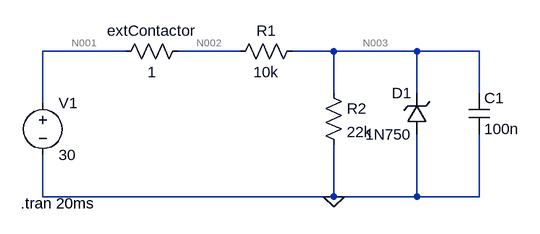
[diagram p0: schematic din.asc]
din.asc, the LTspice schematic file:
Version 4
SHEET 1 880 680
WIRE 112 96 -16 96
WIRE 288 96 192 96
WIRE 432 96 368 96
WIRE 560 96 432 96
WIRE 656 96 560 96
WIRE 432 160 432 96
WIRE 560 160 560 96
WIRE 656 160 656 96
WIRE -16 176 -16 96
WIRE -16 320 -16 256
WIRE 432 320 432 240
WIRE 432 320 -16 320
WIRE 560 320 560 224
WIRE 560 320 432 320
WIRE 656 320 656 224
WIRE 656 320 560 320
FLAG 432 320 0
SYMBOL voltage -16 160 R0
WINDOW 123 0 0 Left 2
WINDOW 39 0 0 Left 2
SYMATTR InstName V1
SYMATTR Value 30
SYMBOL res 208 80 R90
WINDOW 0 0 56 VBottom 2
WINDOW 3 32 56 VTop 2
SYMATTR InstName extContactor
SYMATTR Value 1
SYMBOL res 384 80 R90
WINDOW 0 0 56 VBottom 2
WINDOW 3 32 56 VTop 2
SYMATTR InstName R1
SYMATTR Value 10k
SYMBOL res 416 144 R0
SYMATTR InstName R2
SYMATTR Value 22k
SYMBOL zener 576 224 R180
WINDOW 0 24 64 Left 2
WINDOW 3 24 0 Left 2
SYMATTR InstName D1
SYMATTR Value 1N750
SYMATTR Description Diode
SYMATTR Type diode
SYMBOL cap 640 160 R0
SYMATTR InstName C1
SYMATTR Value 100n
TEXT -50 330 Left 2 !.tran 20ms

The netlist it stands for:
* din.asc
V1 N001 0 30
R§extContactor N002 N001 1
R1 N003 N002 10k
R2 N003 0 22k
D1 0 N003 1N750
C1 N003 0 100n
.model D D
.lib standard.dio
.tran 20ms
.backanno
.end

* Results of the author's LTspice run, read from the files saved beside the schematic
* Operating Point, zero values left out:
*   V(n001) = 30 V
*   V(n002) = 30 V
*   V(n003) = 4.566 V
*   I(D1) = -2.336 mA
*   I(R2) = 207.5 µA
*   I(R1) = -2.543 mA
*   I(Extcontactor) = -2.543 mA
*   I(V1) = -2.543 mA